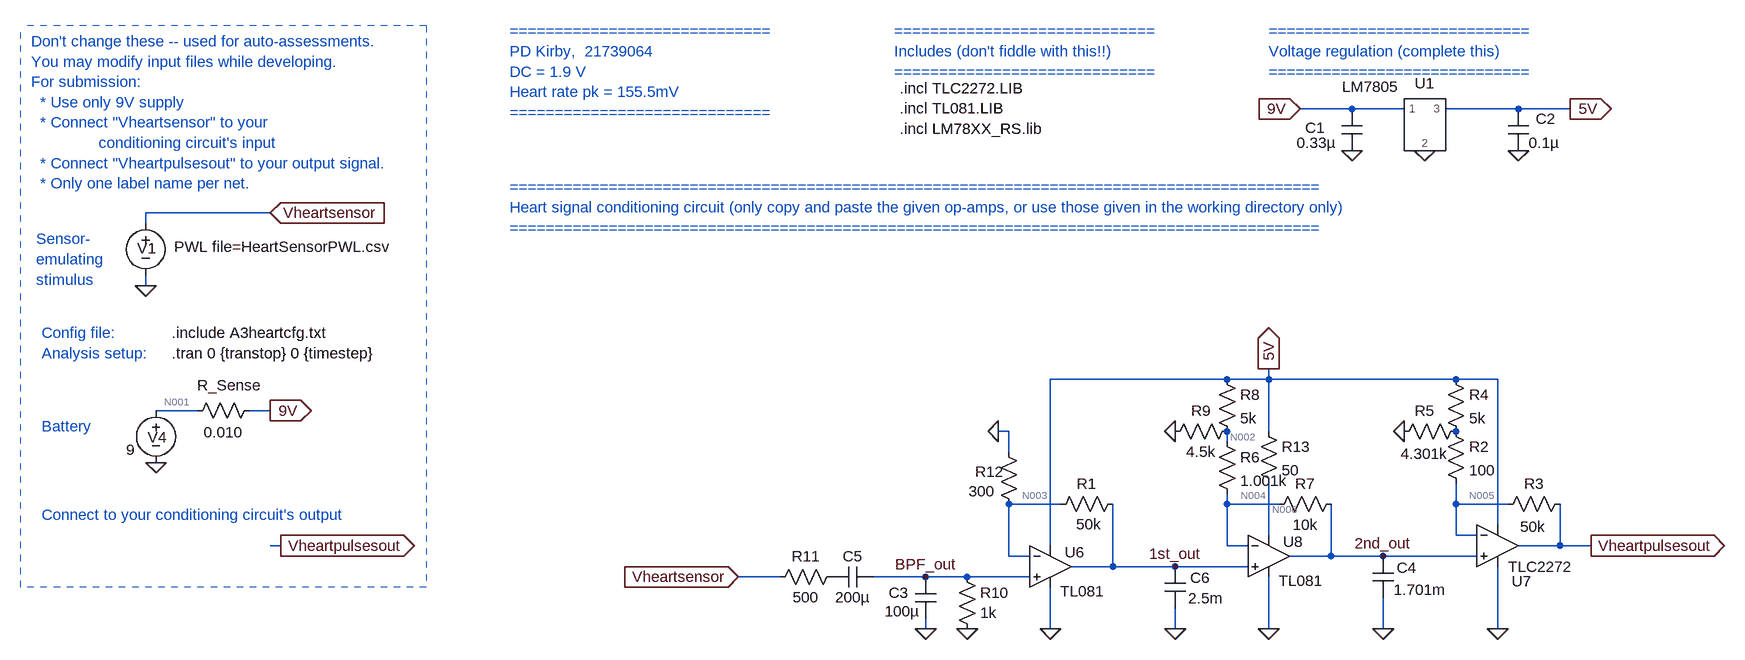
[diagram p0: schematic E344_A3_heart.asc]
E344_A3_heart.asc, the LTspice schematic file:
Version 4
SHEET 1 1824 680
WIRE -256 -1280 -336 -1280
WIRE -176 -1280 -256 -1280
WIRE 0 -1280 -112 -1280
WIRE 80 -1280 0 -1280
WIRE -1920 -1120 -2112 -1120
WIRE -2112 -1104 -2112 -1120
WIRE -2112 -1008 -2112 -1024
WIRE -448 -864 -720 -864
WIRE -384 -864 -384 -880
WIRE -384 -864 -448 -864
WIRE -96 -864 -384 -864
WIRE -32 -864 -96 -864
WIRE -2032 -816 -2096 -816
WIRE -1920 -816 -1952 -816
WIRE -784 -784 -800 -784
WIRE -384 -784 -384 -864
WIRE -448 -768 -448 -784
WIRE -784 -752 -784 -784
WIRE -704 -672 -784 -672
WIRE -448 -672 -448 -688
WIRE -368 -672 -448 -672
WIRE -96 -672 -96 -704
WIRE -16 -672 -96 -672
WIRE -32 -640 -32 -864
WIRE -384 -624 -384 -704
WIRE -96 -624 -96 -672
WIRE -64 -624 -96 -624
WIRE -1904 -608 -1920 -608
WIRE -720 -608 -720 -864
WIRE -448 -608 -448 -672
WIRE -416 -608 -448 -608
WIRE 64 -608 64 -672
WIRE 64 -608 0 -608
WIRE 112 -608 64 -608
WIRE -784 -592 -784 -672
WIRE -752 -592 -784 -592
WIRE -288 -592 -288 -672
WIRE -288 -592 -352 -592
WIRE -208 -592 -288 -592
WIRE -64 -592 -208 -592
WIRE -624 -576 -624 -672
WIRE -624 -576 -688 -576
WIRE -528 -576 -624 -576
WIRE -416 -576 -528 -576
WIRE -1136 -560 -1200 -560
WIRE -912 -560 -992 -560
WIRE -848 -560 -912 -560
WIRE -752 -560 -848 -560
WIRE -912 -480 -912 -496
WIRE -720 -480 -720 -544
WIRE -528 -480 -528 -512
WIRE -384 -480 -384 -560
WIRE -208 -480 -208 -528
WIRE -32 -480 -32 -576
FLAG -2112 -1008 0
FLAG -1920 -1120 Vheartsensor
IOPIN -1920 -1120 In
FLAG -1920 -816 9V
IOPIN -1920 -816 Out
FLAG -2096 -736 0
FLAG -336 -1280 9V
IOPIN -336 -1280 In
FLAG -144 -1216 0
FLAG 80 -1280 5V
IOPIN 80 -1280 Out
FLAG -1904 -608 Vheartpulsesout
IOPIN -1904 -608 Out
FLAG -1200 -560 Vheartsensor
IOPIN -1200 -560 In
FLAG 112 -608 Vheartpulsesout
IOPIN 112 -608 Out
FLAG -720 -480 0
FLAG -800 -784 0
FLAG -32 -480 0
FLAG -176 -784 0
FLAG -384 -480 0
FLAG -528 -784 0
FLAG -912 -480 0
FLAG -208 -480 0
FLAG -528 -480 0
FLAG -848 -480 0
FLAG -912 -560 BPF_out
FLAG -528 -576 1st_out
FLAG -208 -592 2nd_out
FLAG 0 -1216 0
FLAG -256 -1216 0
FLAG -384 -880 5V
IOPIN -384 -880 Out
SYMBOL voltage -2112 -1120 R0
WINDOW 123 0 0 Left 0
WINDOW 39 0 0 Left 0
WINDOW 3 44 52 Left 2
WINDOW 0 -13 54 Left 2
SYMATTR Value PWL file=HeartSensorPWL.csv
SYMATTR InstName V1
SYMBOL voltage -2096 -832 R0
WINDOW 123 24 44 Left 2
WINDOW 39 0 0 Left 0
WINDOW 3 -46 76 Left 2
WINDOW 0 -13 57 Left 2
SYMATTR Value 9
SYMATTR InstName V4
SYMBOL res -1936 -832 R90
WINDOW 0 -7 47 VBottom 2
WINDOW 3 34 56 VTop 2
SYMATTR InstName R_Sense
SYMATTR Value 0.010
SYMBOL LM7805 -144 -1264 R0
WINDOW 3 -83 -66 Top 2
SYMATTR InstName U1
SYMBOL cap -272 -1280 R0
WINDOW 0 -56 29 Left 2
WINDOW 3 -69 52 Left 2
SYMATTR InstName C1
SYMATTR Value 0.33µ
SYMBOL cap -16 -1280 R0
WINDOW 0 43 15 Left 2
WINDOW 3 32 52 Left 2
SYMATTR InstName C2
SYMATTR Value 0.1µ
SYMBOL Opamps\\opamp2 -720 -640 R0
WINDOW 0 22 42 Left 2
WINDOW 3 15 102 Left 2
SYMATTR InstName U6
SYMATTR Value TL081
SYMBOL res -608 -688 R90
WINDOW 0 0 56 VBottom 2
WINDOW 3 31 53 VTop 2
SYMATTR InstName R1
SYMATTR Value 50k
SYMBOL Opamps\\opamp2 -32 -672 R0
WINDOW 0 22 119 Left 2
SYMATTR InstName U7
SYMATTR Value TLC2272
SYMBOL res -112 -800 R0
SYMATTR InstName R2
SYMATTR Value 100
SYMBOL res 80 -688 R90
WINDOW 0 0 56 VBottom 2
WINDOW 3 35 58 VTop 2
SYMATTR InstName R3
SYMATTR Value 50k
SYMBOL res -112 -880 R0
SYMATTR InstName R4
SYMATTR Value 5k
SYMBOL res -80 -800 R90
WINDOW 0 0 64 VBottom 2
WINDOW 3 35 65 VTop 2
SYMATTR InstName R5
SYMATTR Value 4.301k
SYMBOL res -464 -784 R0
SYMATTR InstName R6
SYMATTR Value 1.001k
SYMBOL res -272 -688 R90
WINDOW 0 0 56 VBottom 2
WINDOW 3 32 56 VTop 2
SYMATTR InstName R7
SYMATTR Value 10k
SYMBOL res -464 -880 R0
SYMATTR InstName R8
SYMATTR Value 5k
SYMBOL res -432 -800 R90
WINDOW 0 0 56 VBottom 2
WINDOW 3 32 56 VTop 2
SYMATTR InstName R9
SYMATTR Value 4.5k
SYMBOL cap -896 -496 R180
WINDOW 0 42 40 Left 2
WINDOW 3 25 11 Left 2
SYMATTR InstName C3
SYMATTR Value 100µ
SYMBOL cap -224 -592 R0
WINDOW 0 37 18 Left 2
WINDOW 3 32 52 Left 2
SYMATTR InstName C4
SYMATTR Value 1.701m
SYMBOL cap -992 -576 R90
WINDOW 0 0 32 VBottom 2
WINDOW 3 32 32 VTop 2
SYMATTR InstName C5
SYMATTR Value 200µ
SYMBOL res -864 -576 R0
WINDOW 3 36 71 Left 2
SYMATTR Value 1k
SYMATTR InstName R10
SYMBOL res -1040 -576 R90
WINDOW 0 0 56 VBottom 2
WINDOW 3 32 56 VTop 2
SYMATTR InstName R11
SYMATTR Value 500
SYMBOL res -800 -768 R0
WINDOW 0 -36 46 Left 2
WINDOW 3 -46 76 Left 2
SYMATTR InstName R12
SYMATTR Value 300
SYMBOL cap -544 -576 R0
WINDOW 0 39 17 Left 2
WINDOW 3 36 49 Left 2
SYMATTR InstName C6
SYMATTR Value 2.5m
SYMBOL res -400 -800 R0
SYMATTR InstName R13
SYMATTR Value 50
SYMBOL Opamps\\opamp2 -384 -656 R0
WINDOW 0 22 42 Left 2
WINDOW 3 15 102 Left 2
SYMATTR InstName U8
SYMATTR Value TL081
TEXT -2072 -904 Left 2 !.tran 0 {transtop} 0 {timestep}
TEXT -2072 -936 Left 2 !.include A3heartcfg.txt
TEXT -2288 -1384 Left 2 ;Don't change these -- used for auto-assessments.\nYou may modify input files while developing.\nFor submission: \n  * Use only 9V supply \n  * Connect "Vheartsensor" to your \n               conditioning circuit's input\n  * Connect "Vheartpulsesout" to your output signal.\n  * Only one label name per net.
TEXT -2272 -936 Left 2 ;Config file:
TEXT -2272 -904 Left 2 ;Analysis setup:
TEXT -2272 -792 Left 2 ;Battery
TEXT -2280 -1080 Left 2 ;Sensor-\nemulating \nstimulus
TEXT -1552 -1400 Left 2 ;=============================\nPD Kirby,  21739064\nDC = 1.9 V\nHeart rate pk = 155.5mV\n=============================
TEXT -1552 -1160 Left 2 ;==========================================================================================\nHeart signal conditioning circuit (only copy and paste the given op-amps, or use those given in the working directory only)\n==========================================================================================
TEXT -384 -1400 Left 2 ;=============================\nVoltage regulation (complete this)\n=============================
TEXT -952 -1312 Left 2 !.incl TLC2272.LIB\n.incl TL081.LIB\n.incl LM78XX_RS.lib
TEXT -2272 -656 Left 2 ;Connect to your conditioning circuit's output
TEXT -960 -1400 Left 2 ;=============================\nIncludes (don't fiddle with this!!)\n=============================
LINE Normal -2304 -544 -2304 -1408 1
LINE Normal -1680 -1408 -1680 -544 1
LINE Normal -1680 -544 -2304 -544 1
LINE Normal -1680 -1408 -2304 -1408 1

The netlist it stands for:
* E344_A3_heart.asc
V1 Vheartsensor 0 PWL file=HeartSensorPWL.csv
V4 N001 0 9
R_Sense 9V N001 0.010
XU1 9V 0 5V LM7805  ; pins 1 2 3
C1 9V 0 0.33µ
C2 5V 0 0.1µ
XU6 BPF_out N003 5V 0 1st_out TL081  ; pins In+ In- V+ V- OUT
R1 1st_out N003 50k
XU7 2nd_out N005 5V 0 Vheartpulsesout TLC2272  ; pins In+ In- V+ V- OUT
R2 P001 N005 100
R3 Vheartpulsesout N005 50k
R4 5V P001 5k
R5 P001 0 4.301k
R6 N002 N004 1.001k
R7 2nd_out N004 10k
R8 5V N002 5k
R9 N002 0 4.5k
C3 0 BPF_out 100µ
C4 2nd_out 0 1.701m
C5 BPF_out P002 200µ
R10 BPF_out 0 1k
R11 P002 Vheartsensor 500
R12 0 N003 300
C6 1st_out 0 2.5m
R13 5V N006 50
XU8 1st_out N004 N006 0 2nd_out TL081  ; pins In+ In- V+ V- OUT
.tran 0 {transtop} 0 {timestep}
.include A3heartcfg.txt
* Don't change these -- used for auto-assessments.
* You may modify input files while developing.
* For submission:
*   * Use only 9V supply
*   * Connect "Vheartsensor" to your
*                conditioning circuit's input
*   * Connect "Vheartpulsesout" to your output signal.
*   * Only one label name per net.
* Config file:
* Analysis setup:
* Battery
* Sensor-
* emulating
* stimulus
* =============================
* PD Kirby,  21739064
* DC = 1.9 V
* Heart rate pk = 155.5mV
* =============================
* ==========================================================================================
* Heart signal conditioning circuit (only copy and paste the given op-amps, or use those given in the working directory only)
* ==========================================================================================
* =============================
* Voltage regulation (complete this)
* =============================
.incl TLC2272.LIB
.incl TL081.LIB
.incl LM78XX_RS.lib
* Connect to your conditioning circuit's output
* =============================
* Includes (don't fiddle with this!!)
* =============================
.lib LM78XX_RS.lib
.backanno
.end

* Results of the author's LTspice run, read from the files saved beside the schematic
* Operating Point, zero values left out:
*   V(vheartsensor) = 1.867 V
*   V(n001) = 9 V
*   V(9v) = 9 V
*   V(5v) = 5.003 V
*   V(1st_out) = 2.74 V
*   V(n003) = 22.3 mV
*   V(bpf_out) = 21 mV
*   V(vheartpulsesout) = 4.982 V
*   V(n005) = 2.436 V
*   V(2nd_out) = 3.318 V
*   V(p001) = 2.431 V
*   V(n002) = 2.538 V
*   V(n004) = 2.609 V
*   V(p002) = 1.867 V
*   V(n006) = 4.881 V
*   I(C6) = -11.43 nA
*   I(C5) = -7.22 pA
*   I(C4) = -1.54 nA
*   I(C3) = 2.526 pA
*   I(R13) = 2.433 mA
*   I(R12) = -74.33 µA
*   I(R11) = -7.22 pA
*   I(R10) = 21 µA
*   I(R9) = 564 µA
*   I(R8) = 493 µA
*   I(R7) = 70.96 µA
*   I(R6) = -70.96 µA
*   I(R5) = 565.3 µA
*   I(R4) = 514.3 µA
*   I(R3) = 50.92 µA
*   I(R2) = -50.92 µA
*   I(R1) = 54.36 µA
*   I(R_sense) = -13.44 mA
*   I(V4) = -13.44 mA
*   I(V1) = -7.22 pA
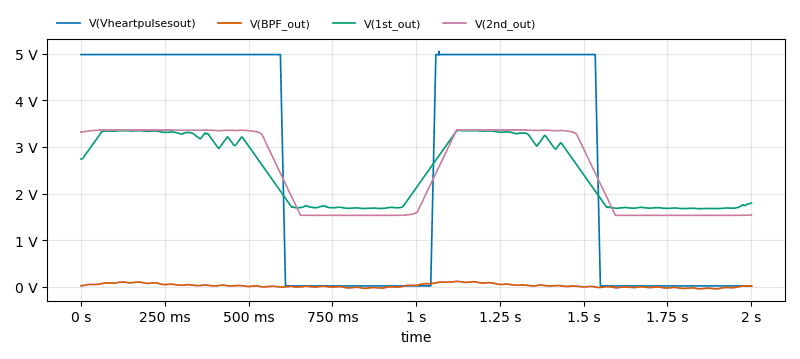
[diagram p1: Transient Analysis of E344_A3_heart.asc, plotted from the saved traces]
* Transient Analysis, 1 run:
*   V(Vheartpulsesout): min -1.364 mV, max 5.054 V, average 2.73 V, rms 3.67 V, last 16.49 mV
*   V(BPF_out): min -45.74 mV, max 114.7 mV, average 21.72 mV, rms 45.54 mV, last 17.58 mV
*   V(1st_out): min 1.674 V, max 3.357 V, average 2.48 V, rms 2.582 V, last 1.797 V
*   V(2nd_out): min 1.531 V, max 3.364 V, average 2.507 V, rms 2.648 V, last 1.538 V